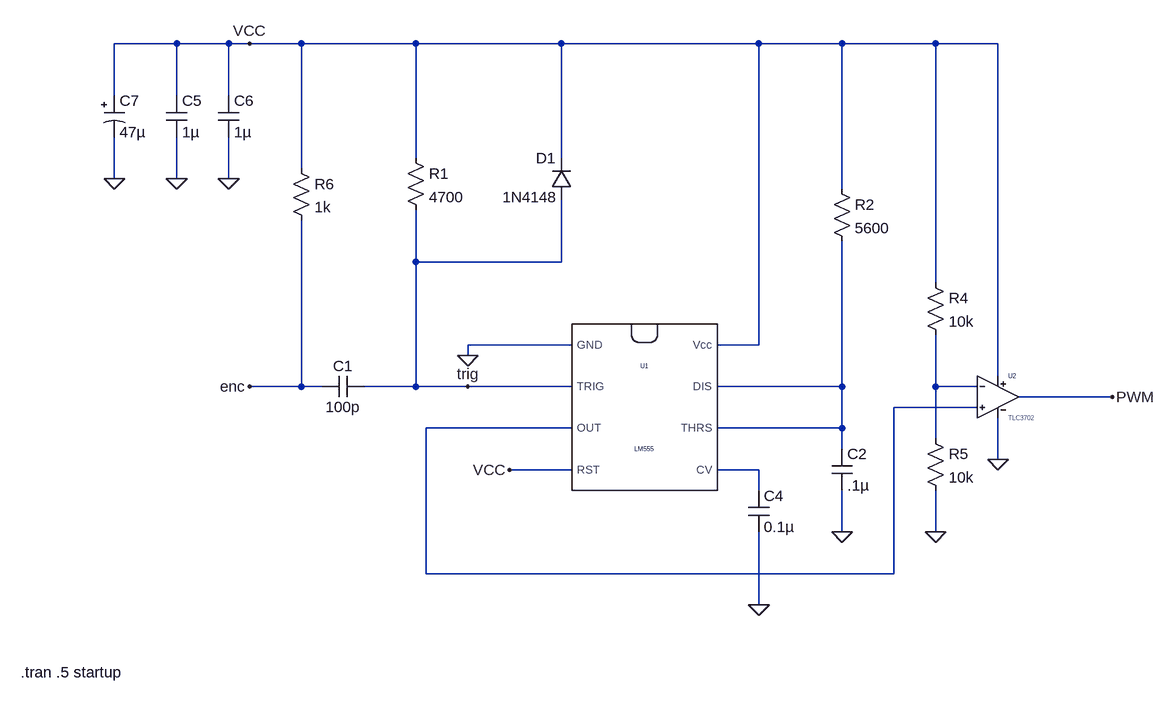
[diagram p0: schematic speed_sensor.asc]
speed_sensor.asc, the LTspice schematic file:
Version 4
SHEET 1 1120 680
WIRE -640 -1088 -736 -1088
WIRE -560 -1088 -640 -1088
WIRE -528 -1088 -560 -1088
WIRE -448 -1088 -528 -1088
WIRE -272 -1088 -448 -1088
WIRE -48 -1088 -272 -1088
WIRE 256 -1088 -48 -1088
WIRE 384 -1088 256 -1088
WIRE 528 -1088 384 -1088
WIRE 624 -1088 528 -1088
WIRE -736 -1008 -736 -1088
WIRE -640 -1008 -640 -1088
WIRE -560 -1008 -560 -1088
WIRE -272 -912 -272 -1088
WIRE -48 -912 -48 -1088
WIRE -448 -896 -448 -1088
WIRE -736 -880 -736 -944
WIRE -640 -880 -640 -944
WIRE -560 -880 -560 -944
WIRE 384 -864 384 -1088
WIRE -272 -752 -272 -832
WIRE -48 -752 -48 -848
WIRE -48 -752 -272 -752
WIRE 528 -720 528 -1088
WIRE -32 -624 -192 -624
WIRE 256 -624 256 -1088
WIRE 256 -624 192 -624
WIRE -192 -608 -192 -624
WIRE 624 -576 624 -1088
WIRE -448 -560 -448 -816
WIRE -448 -560 -528 -560
WIRE -416 -560 -448 -560
WIRE -272 -560 -272 -752
WIRE -272 -560 -352 -560
WIRE -192 -560 -272 -560
WIRE -32 -560 -192 -560
WIRE 384 -560 384 -784
WIRE 384 -560 192 -560
WIRE 528 -560 528 -640
WIRE 592 -560 528 -560
WIRE 800 -544 656 -544
WIRE 592 -528 464 -528
WIRE -32 -496 -256 -496
WIRE 384 -496 384 -560
WIRE 384 -496 192 -496
WIRE 528 -480 528 -560
WIRE 384 -464 384 -496
WIRE 624 -448 624 -512
WIRE -32 -432 -128 -432
WIRE 256 -432 192 -432
WIRE 256 -400 256 -432
WIRE 384 -336 384 -400
WIRE 528 -336 528 -400
WIRE -256 -272 -256 -496
WIRE 464 -272 464 -528
WIRE 464 -272 -256 -272
WIRE 256 -224 256 -336
FLAG -192 -560 trig
FLAG -528 -1088 VCC
FLAG -128 -432 VCC
FLAG -528 -560 enc
FLAG 800 -544 PWM
FLAG 256 -224 0
FLAG 384 -336 0
FLAG 528 -336 0
FLAG 624 -448 0
FLAG -560 -880 0
FLAG -640 -880 0
FLAG -736 -880 0
FLAG -192 -608 0
SYMBOL cap -352 -576 R90
WINDOW 0 0 32 VBottom 2
WINDOW 3 32 32 VTop 2
SYMATTR InstName C1
SYMATTR Value 100p
SYMBOL LM555 80 -528 R0
SYMATTR InstName U1
SYMBOL res -288 -928 R0
SYMATTR InstName R1
SYMATTR Value 4700
SYMATTR SpiceLine tol=5
SYMBOL diode -32 -848 R180
WINDOW 0 24 64 Left 2
WINDOW 3 64 -12 Top 2
SYMATTR InstName D1
SYMATTR Value 1N4148
SYMBOL polcap -752 -1008 R0
WINDOW 3 24 56 Left 2
SYMATTR Value 47µ
SYMATTR InstName C7
SYMATTR Description Capacitor
SYMATTR Type cap
SYMATTR SpiceLine V=6.3 Irms=2.1 Rser=0.028 Lser=0 mfg="KEMET" pn="A700V476M006ATE028" type="Al electrolytic"
SYMBOL cap -656 -1008 R0
SYMATTR InstName C5
SYMATTR Value 1µ
SYMBOL cap -576 -1008 R0
SYMATTR InstName C6
SYMATTR Value 1µ
SYMBOL res 368 -880 R0
SYMATTR InstName R2
SYMATTR Value 5600
SYMBOL cap 368 -464 R0
SYMATTR InstName C2
SYMATTR Value .1µ
SYMBOL cap 240 -400 R0
SYMATTR InstName C4
SYMATTR Value 0.1µ
SYMBOL TLC3702 624 -544 R0
SYMATTR InstName U2
SYMBOL res 512 -736 R0
SYMATTR InstName R4
SYMATTR Value 10k
SYMBOL res 512 -496 R0
SYMATTR InstName R5
SYMATTR Value 10k
SYMBOL res -464 -912 R0
SYMATTR InstName R6
SYMATTR Value 1k
TEXT -880 -120 Left 2 !.tran .5 startup

The netlist it stands for:
* speed_sensor.asc
C1 trig enc 100p
XU1 0 trig N003 VCC N004 N001 N001 VCC NE555  ; pins GND TRIG OUT RST CV THRS DIS Vcc
R1 VCC trig 4700 tol=5
D1 trig VCC 1N4148
C7 VCC 0 47µ V=6.3 Irms=2.1 Rser=0.028 Lser=0 mfg="KEMET" pn="A700V476M006ATE028" type="Al electrolytic"
C5 VCC 0 1µ
C6 VCC 0 1µ
R2 VCC N001 5600
C2 N001 0 .1µ
C4 N004 0 0.1µ
XU2 N003 N002 VCC 0 PWM level.2 Avol=1Meg GBW=2Meg Slew=10Meg ilimit=20m rail=0.2 Vos=0 phimargin=45 en=0 enk=0 in=0 ink=0 Rin=500Meg  ; pins In+ In- V+ V- OUT
R4 VCC N002 10k
R5 N002 0 10k
R6 VCC enc 1k
.model D D
.lib standard.dio
.tran .5 startup
.lib NE555.sub
.lib UniversalOpamps2.sub
.backanno
.end